# Altium schematic sheet PinConnector.SchDoc
size A
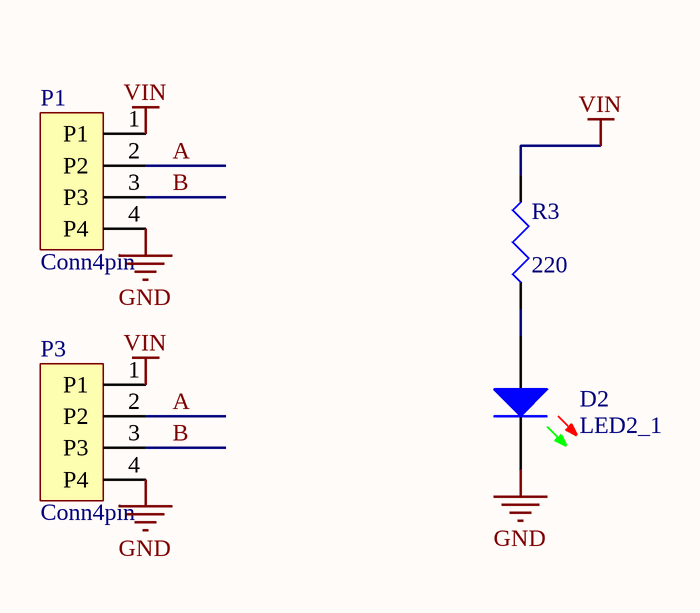
[diagram p0: PinConnector.SchDoc]

## Parts
D2  LED2_1  [LED0603]
P1  Conn4pin  [Bourns 70AB/Female (4 conn)]
P3  Conn4pin  [Connector 4pin 75mil space]
R3  value 220  [0603]

## Nets
GND: D2.2(K) P1.4(P4) P3.4(P4)
VIN: P1.1(P1) P3.1(P1) R3.2
A: P1.2(P2) P3.2(P2)
B: P1.3(P3) P3.3(P3)
NetD2_1: D2.1(A) R3.1

## Library data of the parts
D2 = LED2_1: Typical RED, GREEN, YELLOW, AMBER GaAs LED; Published: 8-Jun-2000; LatestRevisionDate: 17-Jul-2002; LatestRevisionNote: Re-released for DXP Platform.; PackageVersion: Feb-2002; PackageReference: 3.2X1.6X1.1; Publisher: Altium Limited; PackageDescription: SM LED; 2 Flat Leads
R3 = Res3: Resistor; Published: 8-Jun-2000; LatestRevisionDate: 04-Mar-2005; LatestRevisionNote: PCB Footprint replaced.; PackageReference: J1-0603; Publisher: Altium Limited